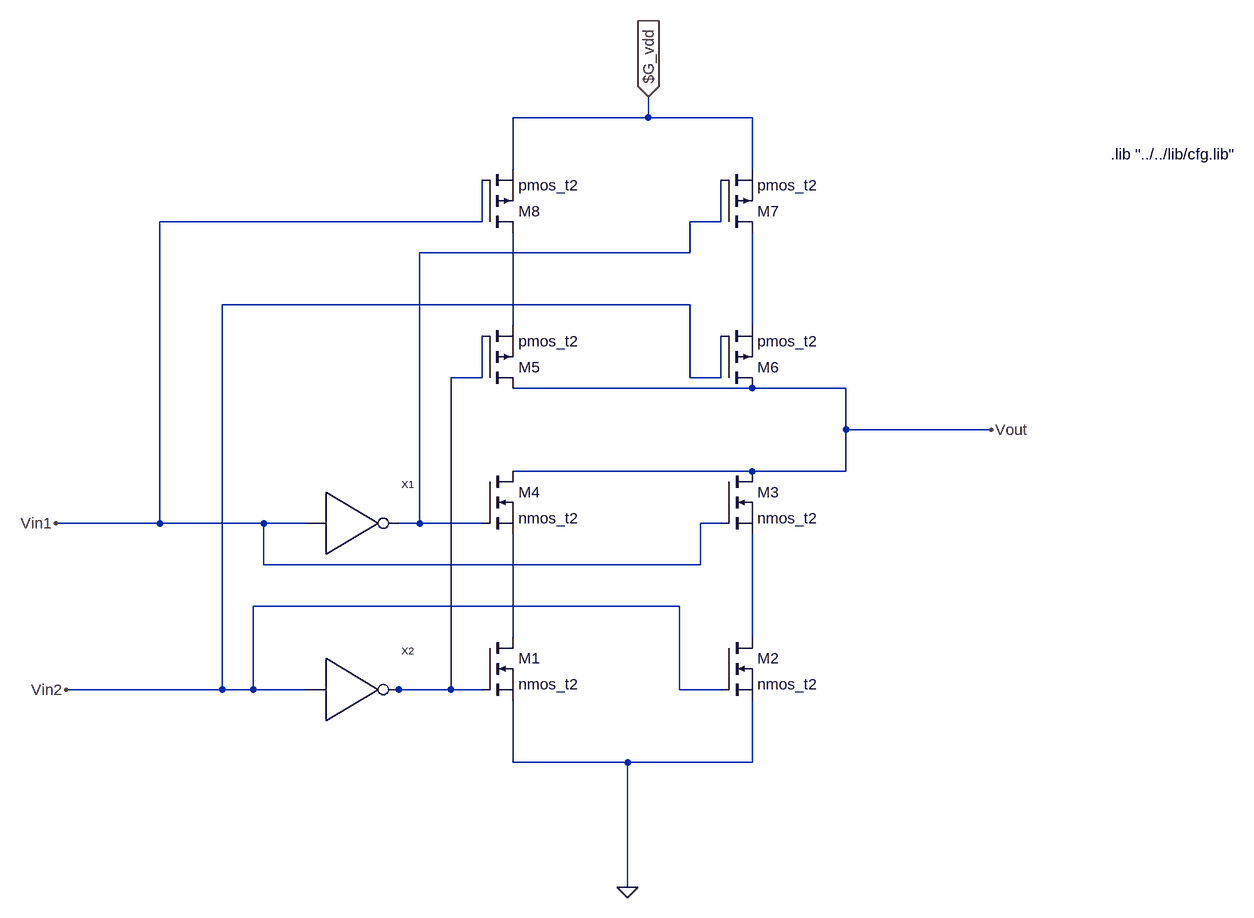
[diagram p0: schematic XOR_2.asc]
XOR_2.asc, the LTspice schematic file:
Version 4
SHEET 1 1252 772
WIRE 304 -432 304 -464
WIRE 304 -432 96 -432
WIRE 464 -432 304 -432
WIRE 96 -352 96 -432
WIRE 464 -352 464 -432
WIRE 48 -272 48 -336
WIRE 48 -272 -448 -272
WIRE 416 -272 416 -336
WIRE 416 -272 368 -272
WIRE 368 -224 368 -272
WIRE 368 -224 -48 -224
WIRE 368 -144 -352 -144
WIRE 96 -112 96 -256
WIRE 464 -112 464 -256
WIRE 48 -32 48 -96
WIRE 48 -32 0 -32
WIRE 368 -32 368 -144
WIRE 416 -32 416 -96
WIRE 416 -32 368 -32
WIRE 464 -16 96 -16
WIRE 608 -16 464 -16
WIRE 608 48 608 -16
WIRE 832 48 608 48
WIRE 464 112 96 112
WIRE 608 112 608 48
WIRE 608 112 464 112
WIRE -448 192 -448 -272
WIRE -448 192 -608 192
WIRE -288 192 -448 192
WIRE -224 192 -288 192
WIRE -48 192 -48 -224
WIRE -48 192 -80 192
WIRE 48 192 -48 192
WIRE 416 192 384 192
WIRE -288 256 -288 192
WIRE 384 256 384 192
WIRE 384 256 -288 256
WIRE 352 320 -304 320
WIRE 96 368 96 208
WIRE 464 368 464 208
WIRE -352 448 -352 -144
WIRE -352 448 -592 448
WIRE -304 448 -304 320
WIRE -304 448 -352 448
WIRE -224 448 -304 448
WIRE -80 448 -96 448
WIRE 0 448 0 -32
WIRE 0 448 -80 448
WIRE 48 448 0 448
WIRE 352 448 352 320
WIRE 416 448 352 448
WIRE 96 560 96 464
WIRE 272 560 96 560
WIRE 464 560 464 464
WIRE 464 560 272 560
WIRE 272 752 272 560
FLAG 304 -464 $G_vdd
IOPIN 304 -464 In
FLAG 832 48 Vout
FLAG -608 192 Vin1
FLAG -592 448 Vin2
FLAG 272 752 0
SYMBOL nmos 48 368 R0
SYMATTR InstName M1
SYMATTR Value nmos_t2
SYMATTR Prefix X
SYMBOL pmos 48 -16 M180
SYMATTR InstName M5
SYMATTR Value pmos_t2
SYMATTR Prefix X
SYMBOL nmos 416 368 R0
SYMATTR InstName M2
SYMATTR Value nmos_t2
SYMATTR Prefix X
SYMBOL nmos 416 112 R0
SYMATTR InstName M3
SYMATTR Value nmos_t2
SYMATTR Prefix X
SYMBOL nmos 48 112 R0
SYMATTR InstName M4
SYMATTR Value nmos_t2
SYMATTR Prefix X
SYMBOL pmos 416 -16 M180
SYMATTR InstName M6
SYMATTR Value pmos_t2
SYMATTR Prefix X
SYMBOL pmos 416 -256 M180
SYMATTR InstName M7
SYMATTR Value pmos_t2
SYMATTR Prefix X
SYMBOL pmos 48 -256 M180
SYMATTR InstName M8
SYMATTR Value pmos_t2
SYMATTR Prefix X
SYMBOL inverter -192 192 R0
SYMATTR InstName X1
SYMBOL inverter -192 448 R0
SYMATTR InstName X2
TEXT 1016 -376 Left 2 !.lib "../../lib/cfg.lib"

The netlist it stands for:
* XOR_2.asc
XM1 N005 N004 0 nmos_t2  ; pins D G S
XM5 Vout N004 N002 pmos_t2  ; pins D G S
XM2 N006 Vin2 0 nmos_t2  ; pins D G S
XM3 Vout Vin1 N006 nmos_t2  ; pins D G S
XM4 Vout N001 N005 nmos_t2  ; pins D G S
XM6 Vout Vin2 N003 pmos_t2  ; pins D G S
XM7 N003 N001 $G_vdd pmos_t2  ; pins D G S
XM8 N002 Vin1 $G_vdd pmos_t2  ; pins D G S
XX1 Vin1 N001 inverter  ; pins Vin Vout
XX2 Vin2 N004 inverter  ; pins Vin Vout
.lib "../../lib/cfg.lib"
.backanno
.end